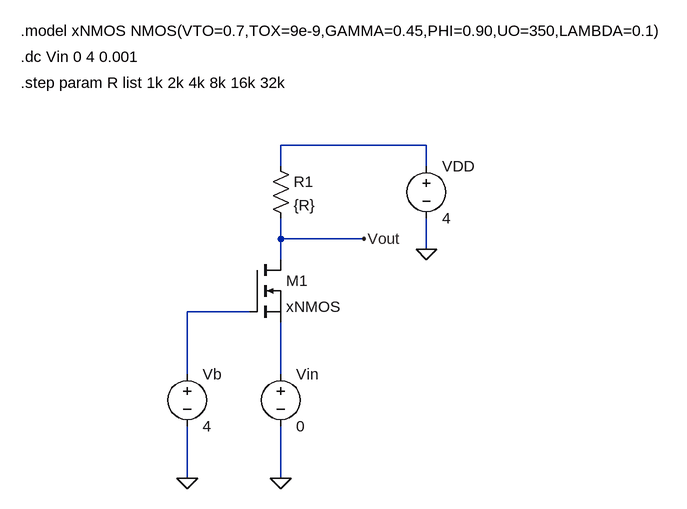
[diagram p0: schematic Chapter03_SPICE08.asc]
Chapter03_SPICE08.asc, the LTspice schematic file:
Version 4
SHEET 1 1244 868
WIRE 672 336 448 336
WIRE 448 368 448 336
WIRE 672 368 672 336
WIRE 448 480 448 448
WIRE 576 480 448 480
WIRE 672 496 672 448
WIRE 448 512 448 480
WIRE 400 592 304 592
WIRE 304 688 304 592
WIRE 448 688 448 608
WIRE 304 848 304 768
WIRE 448 848 448 768
FLAG 448 848 0
FLAG 304 848 0
FLAG 672 496 0
FLAG 576 480 Vout
SYMBOL nmos 400 512 R0
SYMATTR InstName M1
SYMATTR Value xNMOS
SYMBOL voltage 304 672 R0
WINDOW 123 0 0 Left 0
WINDOW 39 0 0 Left 0
SYMATTR InstName Vb
SYMATTR Value 4
SYMBOL voltage 672 352 R0
WINDOW 123 0 0 Left 0
WINDOW 39 0 0 Left 0
SYMATTR InstName VDD
SYMATTR Value 4
SYMBOL voltage 448 672 R0
WINDOW 123 0 0 Left 0
WINDOW 39 0 0 Left 0
SYMATTR InstName Vin
SYMATTR Value 0
SYMBOL res 432 352 R0
SYMATTR InstName R1
SYMATTR Value {R}
TEXT 48 160 Left 2 !.model xNMOS NMOS(VTO=0.7,TOX=9e-9,GAMMA=0.45,PHI=0.90,UO=350,LAMBDA=0.1)
TEXT 48 200 Left 2 !.dc Vin 0 4 0.001
TEXT 48 240 Left 2 !.step param R list 1k 2k 4k 8k 16k 32k

The netlist it stands for:
* Chapter03_SPICE08.asc
M1 Vout N002 N003 N003 xNMOS
Vb N002 0 4
VDD N001 0 4
Vin N003 0 0
R1 N001 Vout {R}
.model NMOS NMOS
.model PMOS PMOS
.lib standard.mos
.model xNMOS NMOS(VTO=0.7,TOX=9e-9,GAMMA=0.45,PHI=0.90,UO=350,LAMBDA=0.1)
.dc Vin 0 4 0.001
.step param R list 1k 2k 4k 8k 16k 32k
.backanno
.end